# Altium project NixieClock_B2.PrjPcb
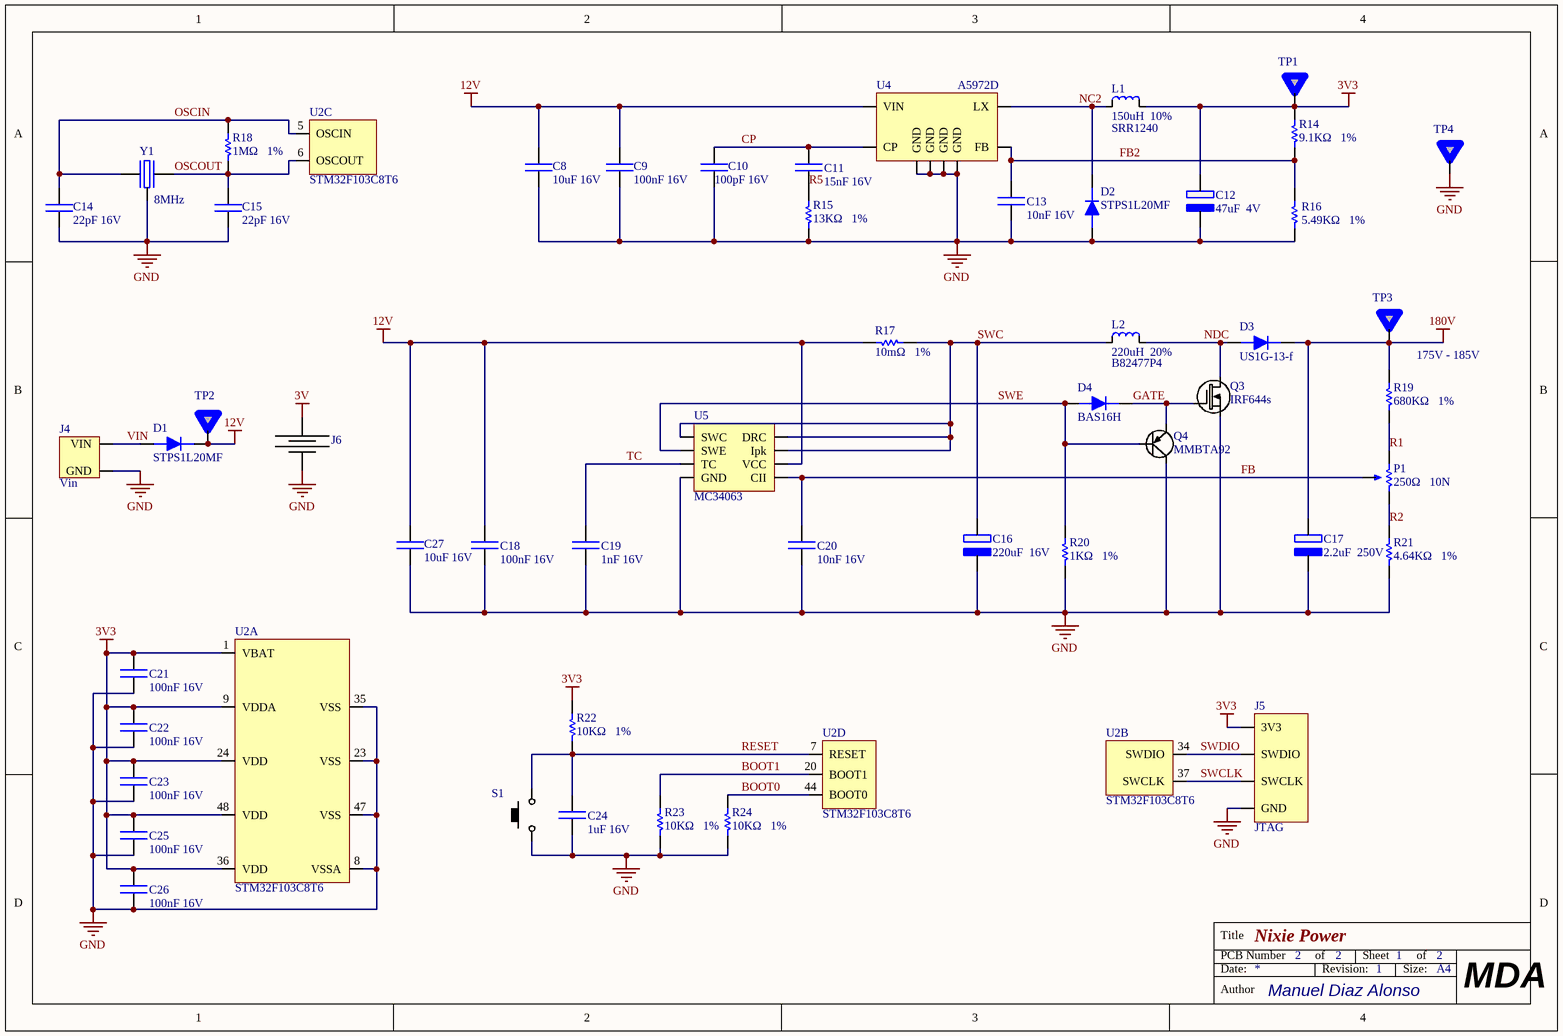
[diagram p0: nixie_power.SchDoc]
2 sheets, 81 parts. Net scope: global (net labels, ports and power ports of the same name join across sheets).
Board file: NixieClock_B2.PcbDoc
Sheets:
  nixie_power.SchDoc
  nixie_peripherals.SchDoc

## Sheet nixie_power.SchDoc: Nixie Power
size A4; Author: Manuel Diaz Alonso; Address1: 2; Address2: 2; Revision: 1; SheetNumber: 1; SheetTotal: 2

### Parts
C8  10uF 16V  [0603]
C9  100nF 16V  [0603]
C10  100pF 16V  [0603]
C11  15nF 16V  [0603]
C12  47uF  4V  [AVX-B-CASE]
C13  10nF 16V  [0603]
C14  22pF 16V  [0603]
C15  22pF 16V  [0603]
C16  220uF  16V  [CAP-SIZE-F]
C17  2.2uF  250V  [CAP-SIZE-F]
C18  100nF 16V  [0603]
C19  1nF 16V  [0603]
C20  10nF 16V  [0603]
C21  100nF 16V  [0603]
C22  100nF 16V  [0603]
C23  100nF 16V  [0603]
C24  1uF 16V  [0603]
C25  100nF 16V  [0603]
C26  100nF 16V  [0603]
C27  10uF 16V  [0603]
D1  STPS1L20MF  [DO-222AA]
D2  STPS1L20MF  [DO-222AA]
D3  US1G-13-f  [SMA]
D4  BAS16H  [SOD-123F]
J4  Vin  [HEADERx2_POL]
J5  JTAG  [PIN_1X4_HDR_RA]
J6  BAT  [120591-1]  (value not drawn)
L1  150uH  10%  [SRR1240]
L2  220uH  20%  [12.5x12.5]
P1  250Ω   10N  [3006P]
Q3  IRF644s  [TO263-3S]
Q4  MMBTA92  [SOT-23]
R14  9.1KΩ   1%  [0603]
R15  13KΩ   1%  [0603]
R16  5.49KΩ   1%  [0603]
R17  10mΩ   1%  [0603]
R18  1MΩ   1%  [0603]
R19  680KΩ   1%  [0603]
R20  1KΩ   1%  [0603]
R21  4.64KΩ   1%  [0603]
R22  10KΩ   1%  [0603]
R23  10KΩ   1%  [0603]
R24  10KΩ   1%  [0603]
S1  RESET  [FSMSM]  (value not drawn)
TP1  TEST-POINT  [Test_Point]  (value not drawn)
TP2  TEST-POINT  [Test_Point]  (value not drawn)
TP3  TEST-POINT  [Test_Point]  (value not drawn)
TP4  TEST-POINT  [Test_Point]  (value not drawn)
U2  STM32F103C8T6  [LQFP48]  (parts A,B,C,D of 9)
U4  A5972D  [SOIC-8]
U5  MC34063  [SOIC-8]
Y1  8MHz  [ABM3B]

### Nets
3V: J6.1(+)
3V3: C12.2 C21.1 C22.1 C23.1 C25.1 C26.1 J5.1(3V3) L1.2 R14.2 R22.2 TP1.1 U2.1(VBAT) U2.9(VDDA) U2.24(VDD) U2.36(VDD) U2.48(VDD)
12V: C8.2 C9.2 C18.2 C27.2 D1.2 R17.1 TP2.1 U4.8(VIN) U5.6(VCC)
180V: C17.2 D3.2 R19.2 TP3.1
GND: C8.1 C9.1 C10.1 C12.1 C13.1 C14.1 C15.1 C16.1 C17.1 C18.1 C19.1 C20.1 C21.2 C22.2 C23.2 C24.1 C25.2 C26.2 C27.1 D2.1 J4.2(GND) J5.4(GND) J6.2(-) Q3.2(S) Q4.3(C) R15.1 R16.2 R20.1 R21.1 R23.1 R24.1 S1.2 TP4.1 U2.8(VSSA) U2.23(VSS) U2.35(VSS) U2.47(VSS) U4.2(GND) U4.3(GND) U4.6(GND) U4.7(GND) U5.4(GND) Y1.3
BOOT0: R24.2 U2.44(BOOT0)
BOOT1: R23.2 U2.20(BOOT1)
CP: C10.2 C11.2 U4.4(CP)
FB: C20.2 P1.2 U5.5(CII)
FB2: C13.2 R14.1 R16.1 U4.5(FB)
GATE: D4.2 Q3.1(G) Q4.2(E)
NC2: D2.2 L1.1 U4.1(LX)
NDC: D3.1 L2.2 Q3.3(D)
OSCIN: C14.2 R18.2 U2.5(OSCIN) Y1.1
OSCOUT: C15.2 R18.1 U2.6(OSCOUT) Y1.2
R1: P1.3 R19.1
R2: P1.1 R21.2
R5: C11.1 R15.2
RESET: C24.2 R22.1 S1.1 U2.7(RESET)
SWC: C16.2 L2.1 R17.2 U5.1(SWC) U5.7(Ipk) U5.8(DRC)
SWCLK: J5.3(SWCLK) U2.37(SWCLK)
SWDIO: J5.2(SWDIO) U2.34(SWDIO)
SWE: D4.1 Q4.1(B) R20.2 U5.2(SWE)
TC: C19.2 U5.3(TC)
VIN: D1.1 J4.1(VIN)

### Notes on the sheet
- (near L1) SRR1240
- (near L2) B82477P4
- 175V - 185V
- Title
- PCB Number
- Date:
- of
- Revision:
- Sheet
- Size:
- A4
- Author
- MDA

### Library data of the parts
C8-C11 C13-C15 C18-C27 = CAP
C12 C16 C17 = CAP_pol
D1-D4 = DIO
J4 = Vin: 282837-2
J5 = JTAG: TSW-104-08-F-S-RA
J6 = BAT: CR2032
L1 = IND: SRR1240
L2 = IND: B82477P4
P1 = POTE
Q3 = N-MOS
Q4 = PNP
R14-R24 = RES
S1 = BUTTON
Y1 = Cristal: ABM3B

## Sheet nixie_peripherals.SchDoc: Nixie Peripherals
size A4; Author: Manuel Diaz Alonso; Address1: 2; Address2: 2; Revision: 1; SheetNumber: 2; SheetTotal: 2
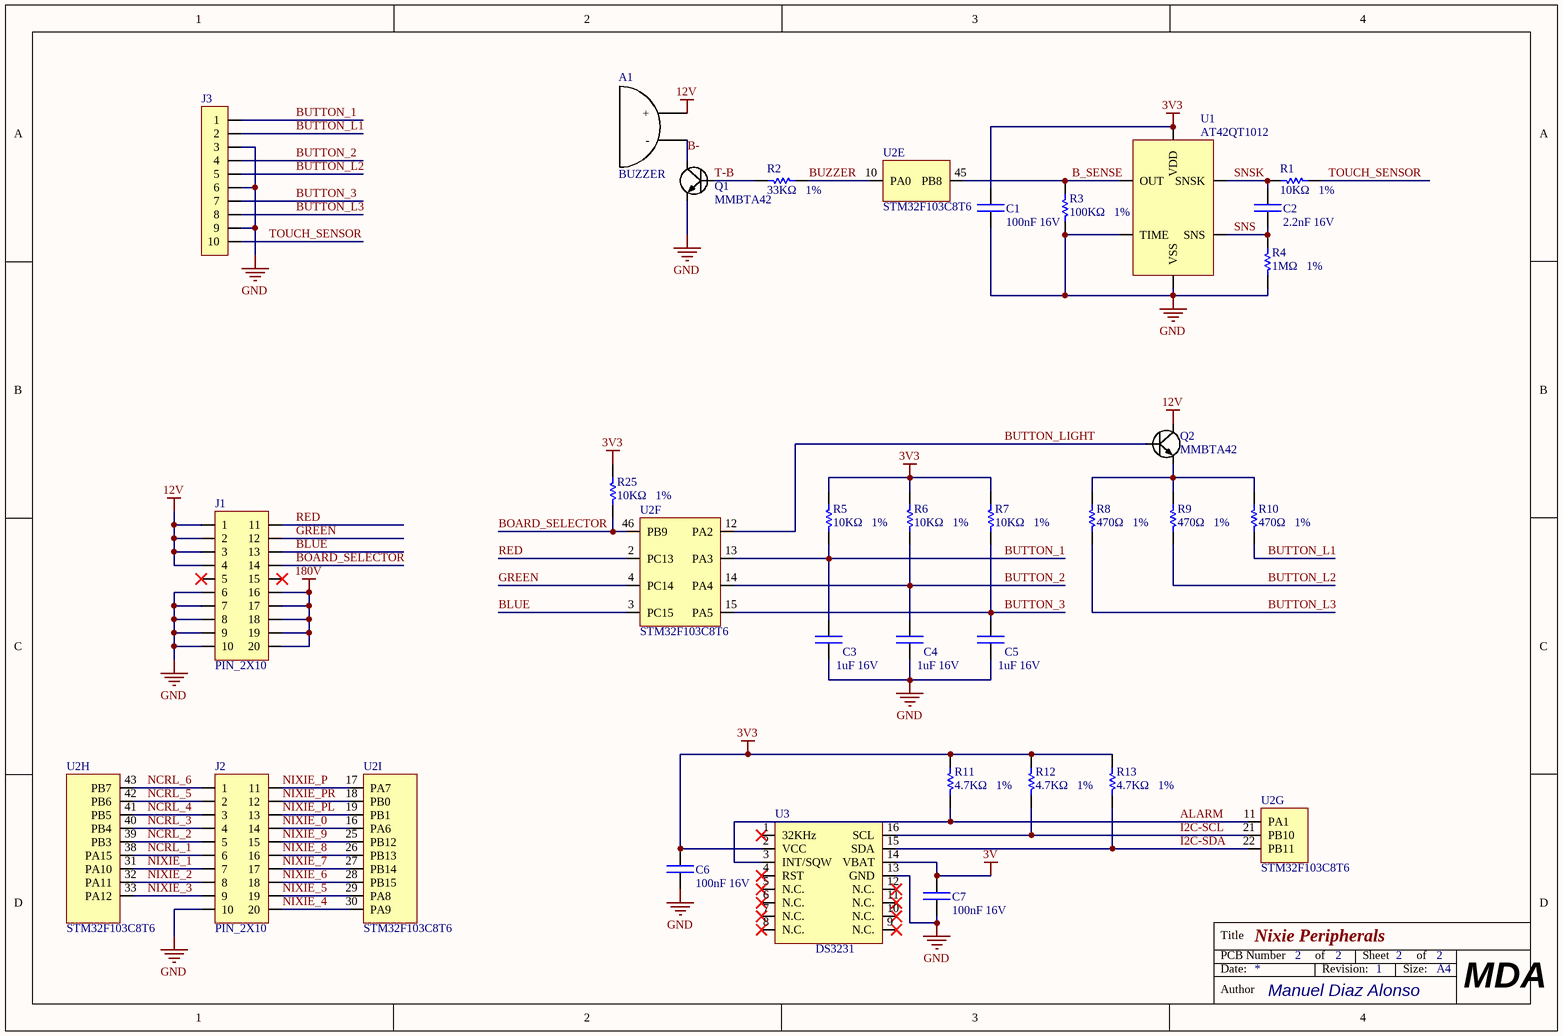
[diagram p1: nixie_peripherals.SchDoc]

### Parts
A1  BUZZER  [BUZZER]
C1  100nF 16V  [0603]
C2  2.2nF 16V  [0603]
C3  1uF 16V  [0603]
C4  1uF 16V  [0603]
C5  1uF 16V  [0603]
C6  100nF 16V  [0603]
C7  100nF 16V  [0603]
J1  PIN_2X10  [PIN_2X10_SKT]
J2  PIN_2X10  [PIN_2X10_SKT]
J3  HEADERx10  [HEADERx10]  (value not drawn)
Q1  MMBTA42  [SOT-23]
Q2  MMBTA42  [SOT-23]
R1  10KΩ   1%  [0603]
R2  33KΩ   1%  [0603]
R3  100KΩ   1%  [0603]
R4  1MΩ   1%  [0603]
R5  10KΩ   1%  [0603]
R6  10KΩ   1%  [0603]
R7  10KΩ   1%  [0603]
R8  470Ω   1%  [0603]
R9  470Ω   1%  [0603]
R10  470Ω   1%  [0603]
R11  4.7KΩ   1%  [0603]
R12  4.7KΩ   1%  [0603]
R13  4.7KΩ   1%  [0603]
R25  10KΩ   1%  [0603]
U1  AT42QT1012  [SOT-23-6]
U2  STM32F103C8T6  [LQFP48]  (parts E,F,G,H,I of 9)
U3  DS3231  [SO16W]

### Nets
3V: C7.2 U3.14(VBAT)
3V3: C1.1 C6.2 R5.2 R6.2 R7.2 R11.2 R12.2 R13.2 R25.1 U1.5(VDD) U3.2(VCC)
12V: A1.1(+) J1.1 J1.2 J1.3 J1.4 Q2.3(C)
180V: J1.16 J1.17 J1.18 J1.19 J1.20
GND: C1.2 C3.1 C4.1 C5.1 C6.1 C7.1 J1.6 J1.7 J1.8 J1.9 J1.10 J2.10 J3.3 J3.6 J3.9 Q1.2(E) R3.1 R4.2 U1.2(VSS) U1.6(TIME) U3.13(GND)
ALARM: R11.1 U2.11(PA1) U3.3(INT/SQW)
B-: A1.2(-) Q1.3(C)
B_SENSE: R3.2 U1.1(OUT) U2.45(PB8)
BLUE: J1.13 U2.3(PC15)
BOARD_SELECTOR: J1.14 R25.2 U2.46(PB9)
BUTTON_1: C3.2 J3.1 R5.1 U2.13(PA3)
BUTTON_2: C4.2 J3.4 R6.1 U2.14(PA4)
BUTTON_3: C5.2 J3.7 R7.1 U2.15(PA5)
BUTTON_L1: J3.2 R10.2
BUTTON_L2: J3.5 R9.2
BUTTON_L3: J3.8 R8.2
BUTTON_LIGHT: Q2.1(B) U2.12(PA2)
BUZZER: R2.2 U2.10(PA0)
GREEN: J1.12 U2.4(PC14)
I2C-SCL: R12.1 U2.21(PB10) U3.16(SCL)
I2C-SDA: R13.1 U2.22(PB11) U3.15(SDA)
NCRL_1: J2.6 U2.38(PA15)
NCRL_2: J2.5 U2.39(PB3)
NCRL_3: J2.4 U2.40(PB4)
NCRL_4: J2.3 U2.41(PB5)
NCRL_5: J2.2 U2.42(PB6)
NCRL_6: J2.1 U2.43(PB7)
NIXIE_0: J2.14 U2.16(PA6)
NIXIE_1: J2.7 U2.31(PA10)
NIXIE_2: J2.8 U2.32(PA11)
NIXIE_3: J2.9 U2.33(PA12)
NIXIE_4: J2.20 U2.30(PA9)
NIXIE_5: J2.19 U2.29(PA8)
NIXIE_6: J2.18 U2.28(PB15)
NIXIE_7: J2.17 U2.27(PB14)
NIXIE_8: J2.16 U2.26(PB13)
NIXIE_9: J2.15 U2.25(PB12)
NIXIE_P: J2.11 U2.17(PA7)
NIXIE_PL: J2.13 U2.19(PB1)
NIXIE_PR: J2.12 U2.18(PB0)
RED: J1.11 U2.2(PC13)
SNS: C2.2 R4.1 U1.4(SNS)
SNSK: C2.1 R1.2 U1.3(SNSK)
T-B: Q1.1(B) R2.1
TOUCH_SENSOR: J3.10 R1.1
NetQ2_2: Q2.2(E) R8.1 R9.1 R10.1

Not connected (* = marked no-connect by the designer): J1 5* 15*; U3 1(32KHz)* 4(RST)* 5(N.C.)* 6(N.C.)* 7(N.C.)* 8(N.C.)* 9(N.C.)* 10(N.C.)* 11(N.C.)* 12(N.C.)*

### Notes on the sheet
- Title
- PCB Number
- Date:
- of
- Revision:
- Sheet
- Size:
- A4
- Author
- MDA

### Library data of the parts
C1-C7 = CAP
J1 J2 = PIN_2X10: SSW-110-01-L-D; System: Connector
J3 = HEADERx10: 1-282837-0
Q1 Q2 = NPN
R1-R13 R25 = RES

## Nets that join several sheets
3V: nixie_power (J6.1), nixie_peripherals (C7.2 U3.14)
3V3: nixie_power (16 pins), nixie_peripherals (11 pins)
12V: nixie_power (9 pins), nixie_peripherals (6 pins)
180V: nixie_power (C17.2 D3.2 R19.2 TP3.1), nixie_peripherals (5 pins)
GND: nixie_power (43 pins), nixie_peripherals (21 pins)